# EAGLE schematic Evaporometer_OnePiece (EAGLE 9.6.2)
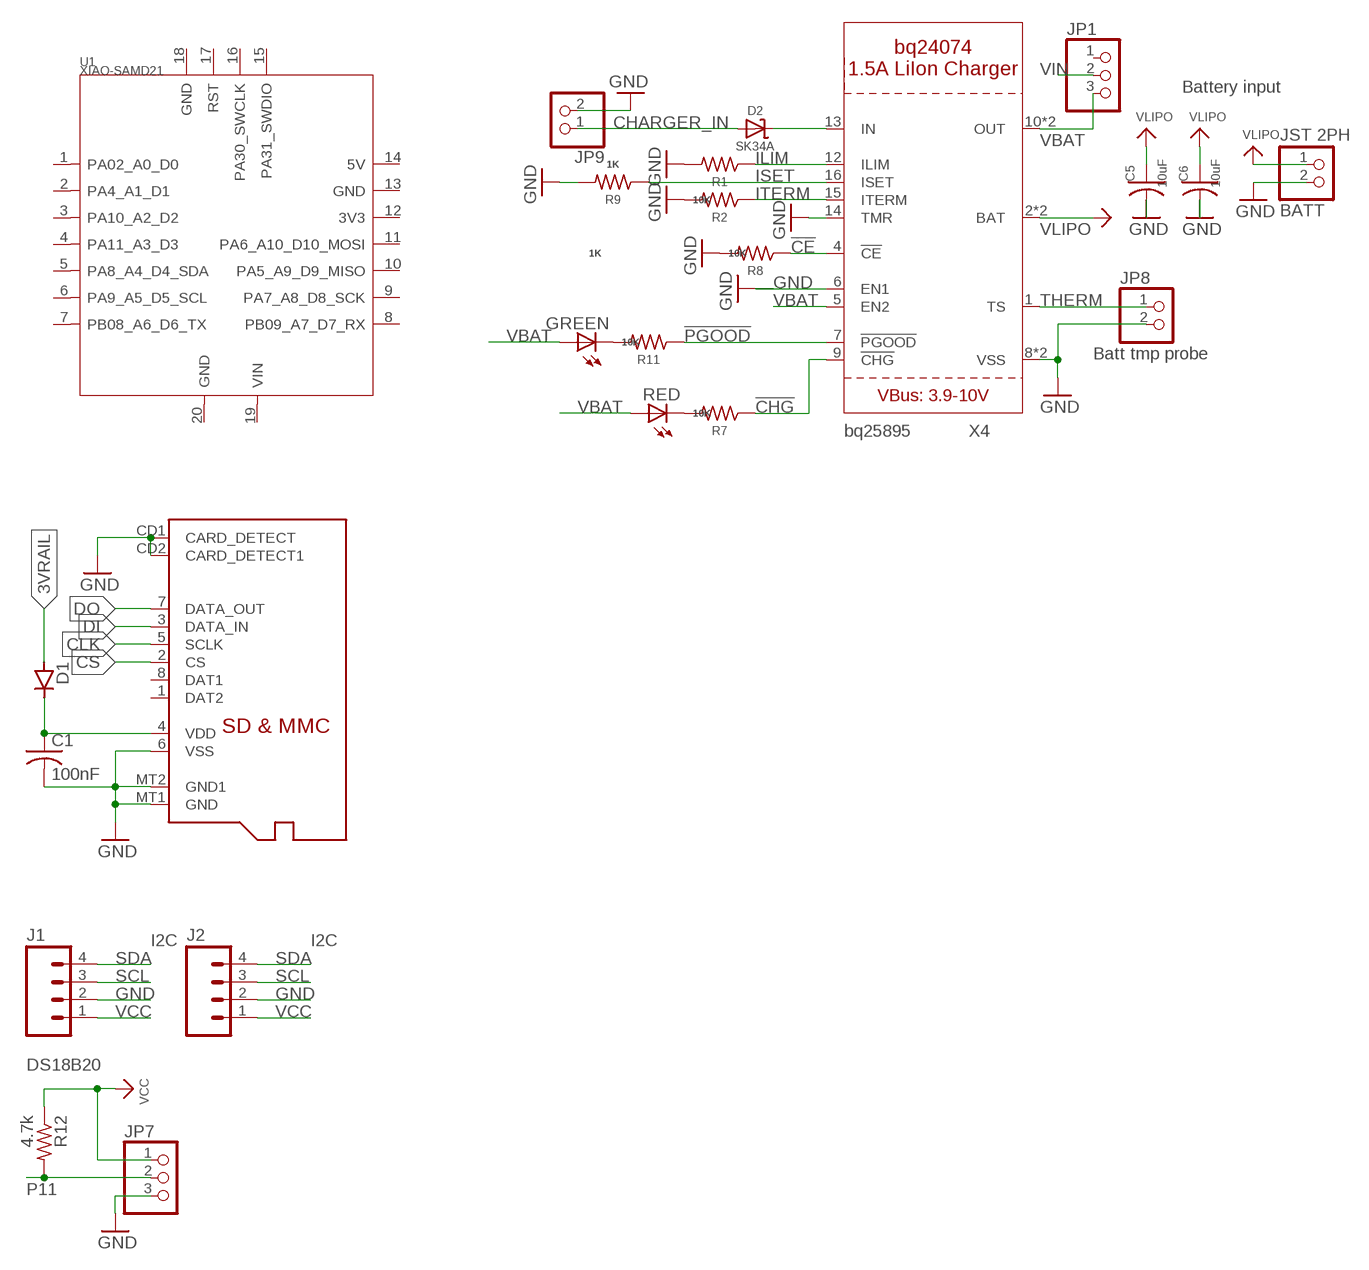
[diagram p0: schematic, sheet 1, part 1 of 2]
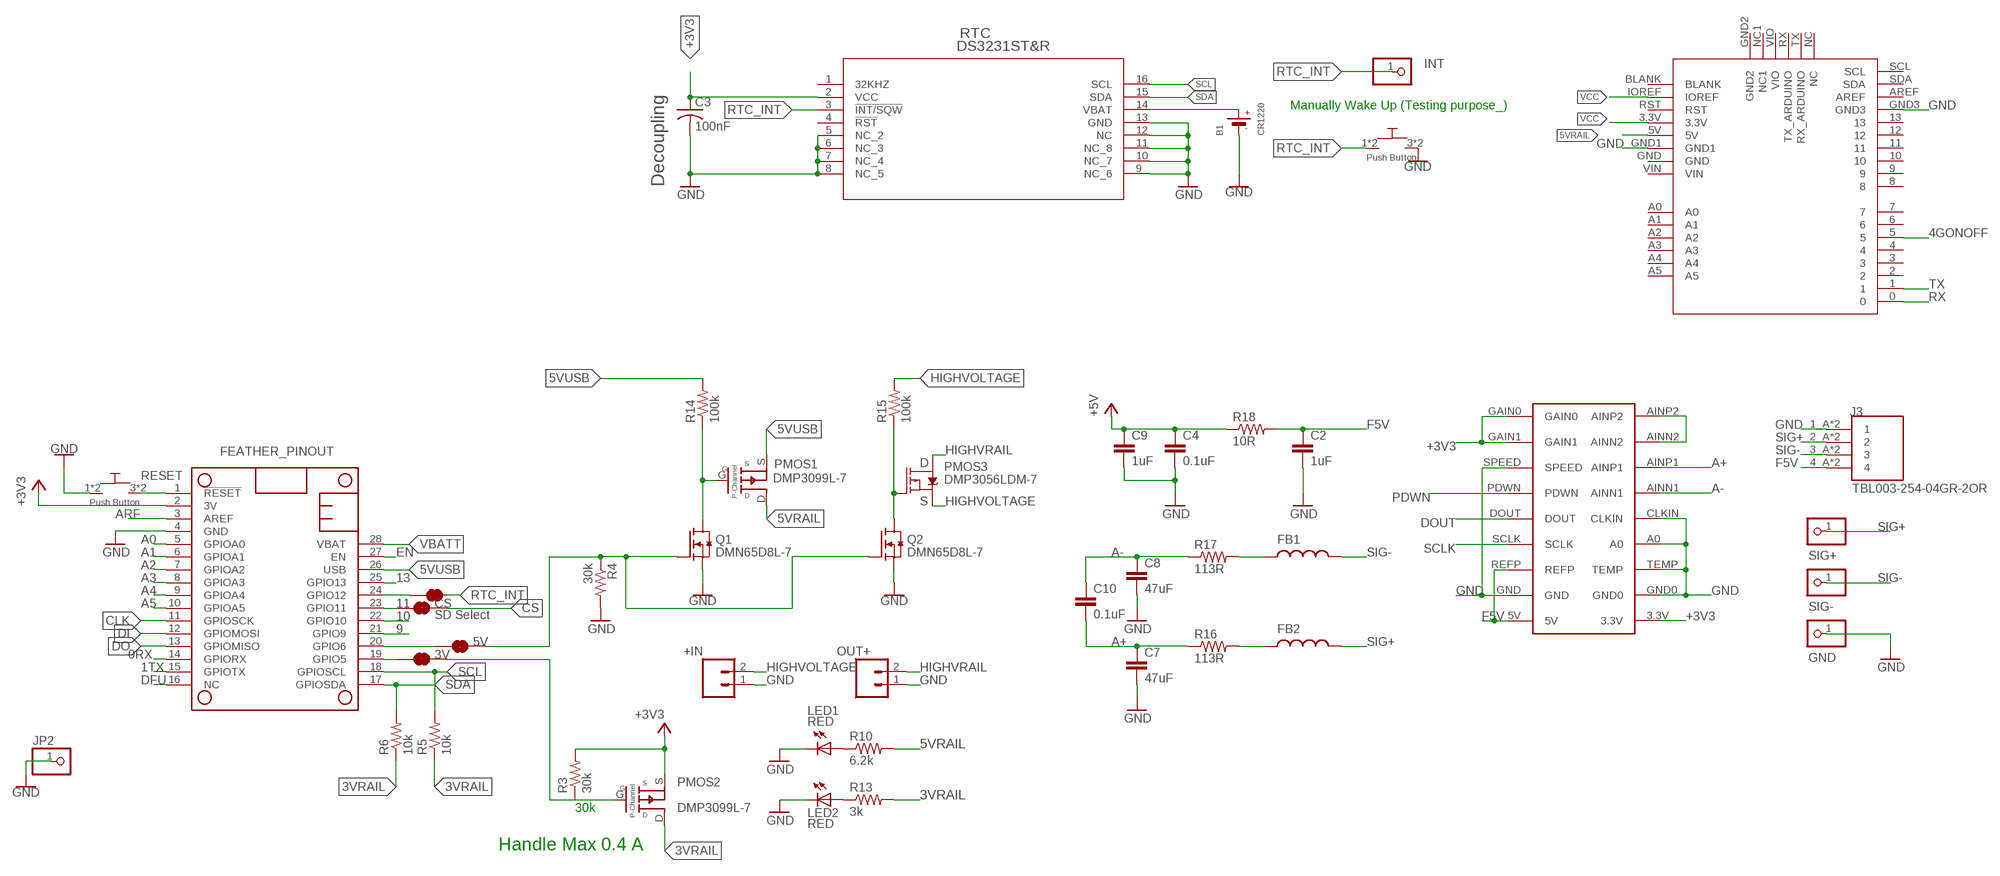
[diagram p1: schematic, sheet 1, part 2 of 2]

## Parts
3V  JUMPER-SMT_2_NC_TRACE_SILK  [SMT-JUMPER_2_NC_TRACE_SILK]
5V  JUMPER-SMT_2_NC_TRACE_SILK  [SMT-JUMPER_2_NC_TRACE_SILK]
+IN  HIGHV-IN  CONN_021X02_NO_SILK  [1X02_NO_SILK]
ADS1232  ADS1232  [ADS1232]
B1  CR1220  BATTERYCR1220_SMT  [CR1220]
BATT  JST 2PH  JST_2PIN-SMT-RA  [JST-PH-2-SMT-RA]
C1  100nF  C-USC1206  [C1206]
C2  1uF  C-EUC0805  [C0805]
C3  100nF  C-USC1206  [C1206]
C4  0.1uF  C-EUC0805  [C0805]
C5  10uF  C-USC0805K  [C0805K]
C6  10uF  C-USC0805K  [C0805K]
C7  47uF  C-EUC0805  [C0805]
C8  47uF  C-EUC0805  [C0805]
C9  1uF  C-EUC0805  [C0805]
C10  0.1uF  C-EUC0805  [C0805]
CS  SD Select  JUMPER-SMT_2_NC_TRACE_SILK  [SMT-JUMPER_2_NC_TRACE_SILK]
D1  D-SOD123  [SOD123]
D2  SK34A  DIODE-SCHOTTKYSMA  [SMADIODE]
FB1  WE-RFI_0805A_744760282A  [WE-RFI_0805A]
FB2  WE-RFI_0805A_744760282A  [WE-RFI_0805A]
GND  PINHD-1X1  [1X01]
GREEN  LEDSMT1206  [1206]
INT  PINHD-1X1CB  [1X01-CLEANBIG]
J1  M04PTH  [1X04]
J2  M04PTH  [1X04]
J3  TBL003-254-04GR-2OR  [CUI_TBL003-254-04GR-2OR]
JP1  PINHD-1X3  [1X03]
JP2  PINHD-1X1CB  [1X01-CLEANBIG]
JP7  PINHD-1X3  [1X03]
JP8  PINHD-1X2  [1X02]
JP9  PINHD-1X2  [1X02]
LED1  RED  LEDCHIPLED_0805  [CHIPLED_0805]
LED2  RED  LEDCHIPLED_0805  [CHIPLED_0805]
MICROSD  MICROSD  [MICROSD]
MS2  FEATHER_PINOUT  FEATHERWING  [FEATHERWING]
OUT+  HIGHV-OUT  CONN_021X02_NO_SILK  [1X02_NO_SILK]
PMOS1  DMP3099L-7  SSM3J3228R  [SOT-23-3]
PMOS2  DMP3099L-7  SSM3J3228R  [SOT-23-3]
PMOS3  DMP3056LDM-7  P-MOSFET  [SOT23-6]
Q1  DMN65D8L-7  NMOS  [SOT23-S]
Q2  DMN65D8L-7  NMOS  [SOT23-S]
R1  1K  R-US_M0805  [M0805]
R2  10K  R-US_M0805  [M0805]
R3  30k  WSLP1206R0500FEA  [RES_1206]
R4  30k  WSLP1206R0500FEA  [RES_1206]
R5  10k  WSLP1206R0500FEA  [RES_1206]
R6  10k  WSLP1206R0500FEA  [RES_1206]
R7  10K  R-US_M0805  [M0805]
R8  10K  R-US_M0805  [M0805]
R9  1K  R-US_M0805  [M0805]
R10  6.2k  WSLP1206R0500FEA  [RES_1206]
R11  10K  R-US_M0805  [M0805]
R12  4.7k  FLIPFLOP-RES  [0805-THM]
R13  3k  WSLP1206R0500FEA  [RES_1206]
R14  100k  WSLP1206R0500FEA  [RES_1206]
R15  100k  WSLP1206R0500FEA  [RES_1206]
R16  113R  R-US_R0805  [R0805]
R17  113R  R-US_R0805  [R0805]
R18  10R  R-US_R0805  [R0805]
RED  LEDSMT1206  [1206]
RTC  DS3231ST&R  [21-0042B_16]
RTC_INT  JUMPER-SMT_2_NC_TRACE_SILK  [SMT-JUMPER_2_NC_TRACE_SILK]
SIG+  PINHD-1X1  [1X01]
SIG-  PINHD-1X1  [1X01]
U1  XIAO-SAMD21  [XIAO-SAMD21/RP2040-MODULE14P-2.54-21X17.8MM]
U$1  PUSH_BUTTON  [PUSHBUTTON_SMD]
U$2  LTE_BOARD  [LTE_BOARD_FOOTPRINT]
U$3  PUSH_BUTTON  [PUSHBUTTON_SMD]
X4  BQ24074  [QFN16_3MM]

## Nets
0RX: MS2.14(GPIORX)
1TX: MS2.15(GPIOTX)
3VRAIL: D1.2(A) PMOS2.D R5.1 R6.1 R13.2
4GONOFF: U$2.5
5VRAIL: PMOS1.D R10.2 U$2.5V
5VUSB: MS2.26(USB) PMOS1.S R14.2
9: MS2.21(GPIO9)
10: MS2.22(GPIO10)
11: CS.1 MS2.23(GPIO11)
13: MS2.25(GPIO13)
!CE: R8.1 X4.4(!CE)
!CHG: R7.1 X4.9(!CHG)
!PGOOD: R11.1 X4.7(!PGOOD)
+3V3: ADS1232.3.3V ADS1232.GAIN0 ADS1232.GAIN1 C3.1 MS2.2(3V) PMOS2.S R3.2 RTC.2(VCC)
+5V: C4.1 C9.1 R18.1
A0: MS2.5(GPIOA0)
A1: MS2.6(GPIOA1)
A2: MS2.7(GPIOA2)
A3: MS2.8(GPIOA3)
A4: MS2.9(GPIOA4)
A5: MS2.10(GPIOA5)
A+: ADS1232.AINP1 C7.1 C10.2 R16.1
A-: ADS1232.AINN1 C8.1 C10.1 R17.1
ARF: MS2.3(AREF)
CHARGER_IN: D2.A JP9.1
CLK: MICROSD.5(SCLK) MS2.11(GPIOSCK)
CS: CS.2 MICROSD.2(CS)
DFU: MS2.16(NC)
DI: MICROSD.3(DATA_IN) MS2.12(GPIOMOSI)
DO: MICROSD.7(DATA_OUT) MS2.13(GPIOMISO)
DOUT: ADS1232.DOUT
EN: MS2.27(EN)
F5V: ADS1232.5V ADS1232.REFP C2.1 J3.4_A J3.4_B R18.2
GND: +IN.1 ADS1232.A0 ADS1232.AINN2 ADS1232.AINP2 ADS1232.CLKIN ADS1232.GND ADS1232.GND0 ADS1232.SPEED ADS1232.TEMP B1.- BATT.2 C1.2 C2.2 C3.2 C4.2 C5.2 C6.2 C7.2 C8.2 C9.2 GND.1 J1.2 J2.2 J3.1_A J3.1_B JP2.1 JP7.3 JP8.2 JP9.2 LED1.C LED2.C MICROSD.6(VSS) MICROSD.CD1(CARD_DETECT) MICROSD.CD2(CARD_DETECT1) MICROSD.MT1(GND) MICROSD.MT2(GND1) MS2.4(GND) OUT+.1 Q1.2(S) Q2.2(S) R1.2 R2.2 R4.2 R8.2 R9.2 RTC.5(NC_2) RTC.6(NC_3) RTC.7(NC_4) RTC.8(NC_5) RTC.9(NC_6) RTC.10(NC_7) RTC.11(NC_8) RTC.12(NC) RTC.13(GND) U$1.3 U$1.4 U$2.GND1 U$2.GND3 U$3.1 U$3.2 X4.6(EN1) X4.8(VSS) X4.14(TMR) X4.THERMAL(VSS)
HIGHVOLTAGE [HIGHVOLTAGE]: +IN.2 PMOS3.4(S) R15.2
HIGHVRAIL [HIGHVOLTAGE]: OUT+.2 PMOS3.1(D) PMOS3.2(D) PMOS3.5(D) PMOS3.6(D)
ILIM: R1.1 X4.12(ILIM)
ISET: R9.1 X4.16(ISET)
ITERM: R2.1 X4.15(ITERM)
N$1: GREEN.C R11.2
N$2: D2.C X4.13(IN)
N$3: R7.2 RED.C
N$4: B1.+$1(+) RTC.14(VBAT)
N$5: 5V.1 MS2.20(GPIO6)
N$6: 3V.1 MS2.19(GPIO5)
N$7: 3V.2 PMOS2.G R3.1
N$8: 5V.2 Q1.1(G) Q2.1(G) R4.1
N$10: PMOS1.G Q1.3(D) R14.1
N$11: FB1.1 R17.2
N$12: LED1.A R10.1
N$13: LED2.A R13.1
N$14: MS2.24(GPIO12) RTC_INT.1
N$15: PMOS3.3(G) Q2.3(D) R15.1
N$16: FB2.1 R16.2
P11: JP7.2 R12.2
PDWN: ADS1232.PDWN
RESET: MS2.1(!RESET) U$3.3 U$3.4
RTC_INT: INT.1 RTC.3(!INT/SQW) RTC_INT.2 U$1.1 U$1.2
RX: U$2.0
SCL: J1.3 J2.3 MS2.18(GPIOSCL) R5.2 RTC.16(SCL)
SCLK: ADS1232.SCLK
SDA: J1.4 J2.4 MS2.17(GPIOSDA) R6.2 RTC.15(SDA)
SIG+: FB2.2 J3.2_A J3.2_B SIG+.1
SIG-: FB1.2 J3.3_A J3.3_B SIG-.1
THERM: JP8.1 X4.1(TS)
TX: U$2.1
VBAT: GREEN.A JP1.3 RED.A X4.5(EN2) X4.10(OUT) X4.11(OUT)
VBATT: MS2.28(VBAT)
VCC: J1.1 J2.1 JP7.1 R12.1 U$2.3.3V U$2.IOREF
VDD: C1.1 D1.1(C) MICROSD.4(VDD)
VIN: JP1.2
VLIPO: BATT.1 C5.1 C6.1 X4.2(BAT) X4.3(BAT)
Unconnected: JP1.1 MICROSD.1(DAT2) MICROSD.8(DAT1) RTC.1(32KHZ) RTC.4(!RST) U1.1(PA02_A0_D0) U1.2(PA4_A1_D1) U1.3(PA10_A2_D2) U1.4(PA11_A3_D3) U1.5(PA8_A4_D4_SDA) U1.6(PA9_A5_D5_SCL) U1.7(PB08_A6_D6_TX) U1.8(PB09_A7_D7_RX) U1.9(PA7_A8_D8_SCK) U1.10(PA5_A9_D9_MISO) U1.11(PA6_A10_D10_MOSI) U1.12(3V3) U1.13(GND) U1.14(5V) U1.15(PA31_SWDIO) U1.16(PA30_SWCLK) U1.17(RST) U1.18(GND) U1.19(VIN) U1.20(GND) U$2.2 U$2.3 U$2.4 U$2.6 U$2.7 U$2.8 U$2.9 U$2.10 U$2.11 U$2.12 U$2.13 U$2.A0 U$2.A1 U$2.A2 U$2.A3 U$2.A4 U$2.A5 U$2.AREF U$2.BLANK U$2.GND U$2.GND2 U$2.NC U$2.NC1 U$2.RST U$2.RX(TX_ARDUINO) U$2.SCL U$2.SDA U$2.TX(RX_ARDUINO) U$2.VIN U$2.VIO

## Notes on the sheet
- Battery input
- Batt tmp probe
- Manually Wake Up (Testing purpose_)
- Decoupling
- I2C | I2C
- DS18B20
- D
- S
- 30k
- Handle Max 0.4 A

## Library data of the parts
3V 5V CS RTC_INT = SparkFun-Jumpers:JUMPER-SMT_2_NC_TRACE: Normally closed trace jumper This jumper has a trace between two pads so it's normally closed (NC). Use a razor knife to open the connection. For best results follow the IPC guidelines for cutting traces: Cutout at least 0.063 mm (0.005 in). Remove all loose material to clean up the cut area. Seal the cut with an approved epoxy. Reapply solder to reclose the connection.
+IN OUT+ = SparkFun-Connectors:CONN_02: Multi connection point. Often used as Generic Header-pin footprint for 0.1 inch spaced/style header connections On any of the 0.1 inch spaced packages, you can populate with these: Break Away Headers - Straight <https://www.sparkfun.com/products/116> (PRT-00116) Break Away Male Headers - Right Angle <https://www.sparkfun.com/products/553> (PRT-00553) Female Headers <https://www.sparkfun.com/products/115> (PRT-00115) Break Away Headers - Machine Pin <https://www.sparkfun.com/products/117> (PRT-00117) Break Away Female Headers - Swiss Machine Pin <https://www.sparkfun.com/products/743> (PRT-00743) For SCREWTERMINALS and SPRING TERMINALS visit here: Screw Terimnals on SparkFun.com <https://www.sparkfun.com/search/results?term=Screw+Terminals> (5mm/3.5mm/2.54mm spacing) This device is also useful as a general connection point to wire up your design to another part of your project. Our various solder wires solder well into these plated through hole pads. Hook-Up Wire - Assortment (Stranded, 22 AWG) <https://www.sparkfun.com/products/11375> (PRT-11375) Hook-Up Wire - Assortment (Solid Core, 22 AWG) <https://www.sparkfun.com/products/11367> (PRT-11367) View the entire wire category on our website here <https://www.sparkfun.com/categories/141> Special notes: Molex polarized connector foot print use with: PRT-08233 with associated crimp pins and housings. 2.54_SCREWTERM for use with PRT-10571. 3.5mm Screw Terminal footprints for PRT-08084 5mm Screw Terminal footprints for use with PRT-08432
ADS1232 = my_lib:ADS1232
B1 = microbuilder:BATTERY: CR1220 SMT - Digikey: 3001K-ND CD2032 BAT-HLD-001 - Digikey: BAT-HLD-001-ND
BATT = adafruit:JST_2PIN: JST 2-Pin Connectors of various flavors SMT-RA (S2B-PH-SM4) 4UConnector #17311 SMT (B2B-PH-SM4) THM-RA (S2B-PH) THM (B2B-PH)
C1 C3 C5 C6 = adafruit:C-US: CAPACITOR, American symbol
C2 C4 C7-C10 = rcl:C-EU: CAPACITOR, European symbol; SPICEPREFIX: C
D1 = semicon-smd-ipc:D-: DIODE unfilled
D2 = microbuilder:DIODE-SCHOTTKY
FB1 FB2 = Wurth_Elektronik_Passive_rev19e:WE-RFI_0805A: Ferrite SMD Inductor Characteristics High thermal stability Operating temperature: –40 °C to +85 °C Applications Especially developed for RF applications RFID Low frequency radio applications (Keyless) <http://katalog.we-online.de/media/images/v2/Family_WE-RFI.jpg> Details see: http://katalog.we-online.de/en/pbs/WE-RFI? Updated by Dan Xu 2014-07-08 2014 (C) Wurth Elektronik; WE-NUMBER: 744760282A/0,82uH
GND SIG+ SIG- = pinhead:PINHD-1X1: PIN HEADER
GREEN LED1 LED2 RED = adafruit:LED: LED OSRAM: - CHIPLED LG R971, LG N971, LY N971, LG Q971, LY Q971, LO R971, LY R971 LH N974, LH R974 LS Q976, LO Q976, LY Q976 LO Q996 - Hyper CHIPLED LW Q18S LB Q993, LB Q99A, LB R99A - SideLED LS A670, LO A670, LY A670, LG A670, LP A670 LB A673, LV A673, LT A673, LW A673 LH A674 LY A675 LS A676, LA A676, LO A676, LY A676, LW A676 LS A679, LY A679, LG A679 - Hyper Micro SIDELED® LS Y876, LA Y876, LO Y876, LY Y876 LT Y87S - SmartLED LW L88C, LW L88S LB L89C, LB L89S, LG L890 LS L89K, LO L89K, LY L89K LS L896, LA L896, LO L896, LY L896 - TOPLED LS T670, LO T670, LY T670, LG T670, LP T670 LSG T670, LSP T670, LSY T670, LOP T670, LYG T670 LG T671, LOG T671, LSG T671 LB T673, LV T673, LT T673, LW T673 LH T674 LS T676, LA T676, LO T676, LY T676, LB T676, LH T676, LSB T676, LW T676 LB T67C, LV T67C, LT T67C, LS T67K, LO T67K, LY T67K, LW E67C LS E67B, LA E67B, LO E67B, LY E67B, LB E67C, LV E67C, LT E67C LW T67C LS T679, LY T679, LG T679 LS T770, LO T770, LY T770, LG T770, LP T770 LB T773, LV T773, LT T773, LW T773 LH T774 LS E675, LA E675, LY E675, LS T675 LS T776, LA T776, LO T776, LY T776, LB T776 LHGB T686 LT T68C, LB T68C - Hyper Mini TOPLED® LB M676 - Mini TOPLED Santana® LG M470 LS M47K, LO M47K, LY M47K Source: http://www.osram.convergy.de/
INT JP2 = adafruit:PINHD-1X1: Pin header 1x1 for 0.1" spacing With round pins
J1 J2 = SparkFun-Connectors:M04: Header 4 Standard 4-pin 0.1" header. Use with straight break away headers (SKU : PRT-00116), right angle break away headers (PRT-00553), swiss pins (PRT-00743), machine pins (PRT-00117), and female headers (PRT-00115). Molex polarized connector foot print use with SKU : PRT-08231 with associated crimp pins and housings. 1MM SMD Version SKU: PRT-10208; PROD_ID: CONN-09696
J3 = TBL003-254-04GR-2OR:TBL003-254-04GR-2OR; AVAILABILITY: Unavailable; CUI_PURCHASE_URL: https://www.cuidevices.com/product/interconnect/connectors/terminal-blocks/tbl003-254-series?utm_source=snapeda.com&utm_medium=referral&utm_campaign=snapedaBOM; DESCRIPTION: 1~24 Poles, Screwless, Horizontal, 2.54 Pitch, 24~20 (AWG), Terminal Block Connector; MF: CUI Devices; MP: TBL003-254-04GR-2OR; PACKAGE: None; PRICE: None
JP1 JP7 = adafruit:PINHD-1X3: PIN HEADER
JP8 JP9 = pinhead:PINHD-1X2: PIN HEADER
MICROSD = adafruit:MICROSD: Micro-SD / Transflash card holder with SPI pinout For the 3M # 2908-05WB-MG and/or 4UCON #19656 push-push type
MS2 = adafruit:FEATHERWING
PMOS1 PMOS2 = M0_Power:SSM3J3228R: PMOS 3.8A (Ta) 1.08W (Ta) Surface Mount SOT-23, 3 pins Source: https://www.digikey.com/en/products/detail/diodes-incorporated/DMP3099L-7/4471075?s=N4IgTCBcDaICIFkAKBmADATgwGQLQHY4BJAYQBVcA5OEAXQF8g Part #: DMP3099L-7DICT-ND; PMOS: P-MOSFET
PMOS3 = eDNA:P-MOSFET: P-Channel 30V 4.3A (Ta) 1.25W (Ta) Surface Mount SOT-26, 6 pins https://www.digikey.com/product-detail/en/diodes-incorporated/DMP3056LDM-7/DMP3056LDMDICT-ND/1964772 Part #: DMP3056LDMDICT-ND
Q1 Q2 = eDNA:NMOS: N-Channel 310mA (Ta) 370mW (Ta) Surface Mount SOT-23, 3 pins https://www.digikey.com/en/products/detail/diodes-incorporated/DMN65D8L-7/3677916 Part #: DMN65D8L-7DICT-ND
R1 R2 R7-R9 R11 = adafruit:R-US_: RESISTOR, American symbol
R3-R6 R10 R13-R15 = Resistor_Capacitor:WSLP1206R0500FEA: RES 0.05 OHM 1% 1W 1206 Manufacturer's datasheet <http://www.vishay.com/docs/30122/wslp.pdf>; CREATED_BY: PCBLayout.com; DIGIKEY_PART_NUMBER: WSLP-.05TR-ND; MANUFACTURER: Vishay Dale; MPN: WSLP1206R0500FEA; PACKAGE: SMD 1206
R12 = adafruit:FLIPFLOP-RES: Flip Flop resistor An 0805 resistor inside a standard 1/4W 5% resistor. Makes for easy mods
R16-R18 = rcl:R-US_: RESISTOR, American symbol; SPICEPREFIX: R
RTC = power8:DS3231ST&R: DS3231 RTC IC only, 16 pins Source: https://www.digikey.com/en/products/detail/maxim-integrated/DS3231SN-T-R/1197577?s=N4IgTCBcDaICIGUDMYkEYEDkDEAVAZAEoDCuAtJnCALoC%2BQA Part #: DS3231SN#T&RCT-ND; MANUFACTURER_PART_NUMBER: DS3231S#T&R; VENDOR: Maxim Integrated Products
U1 = Seeed Studio XIAO Series:XIAO-SAMD21: Seeed Studio XIAO SAMD21 - Microchip ATSAMD21G18 Arduino Microcontroller - 32-bit 48MHz ARM® Cortex® M0+ processor （Seeeduino XIAO) Seeed SKU: 102010328 Seeed Studio XIAO SAMD21 is the smallest Arduino compatible board in Seeeduino Family. It is an Arduino microcontroller that is embedded with the SAMD21 microchip. The interfaces of Seeed Studio XIAO SAMD21 are rich for such a tiny development board and the castellated hole design facilitates automated SMD assembly. Buy now <https://www.seeedstudio.com/Seeeduino-XIAO-Arduino-Microcontroller-SAMD21-Cortex-M0+-p-4426.html> Wiki <https://wiki.seeedstudio.com/Seeeduino-XIAO/>
U$1 U$3 = eDNA:PUSH_BUTTON: SMD low profile push-button NOPE https://www.mouser.com/ProductDetail/ALPS/SKTHAHE010?qs=sGAEpiMZZMsgGjVA3toVBFPD9IcV2kPoEtmOqlcDILk%3D https://www.digikey.com/product-detail/en/c-k/KMR731NG-LFS/CKN10687TR-ND/6035353 https://www.arrow.com/en/products/kmr731nglfs/ck https://www.mouser.com/ProductDetail/CK/KMR731NGLFS?qs=%2Fha2pyFaduiYmAh2YH01EjoHSsd%2F4x%252BsVgk0GVi4JwmLxfMBh2nzdw%3D%3D
U$2 = LTE_BOARD:LTE_BOARD: LTE_BOARD
X4 = adafruit_power:BQ24074

## Net classes
2 HIGHVOLTAGE: clearance 0.3 mm